# Altium project 2012_CARTE_FACTORISEE.PRJPCB
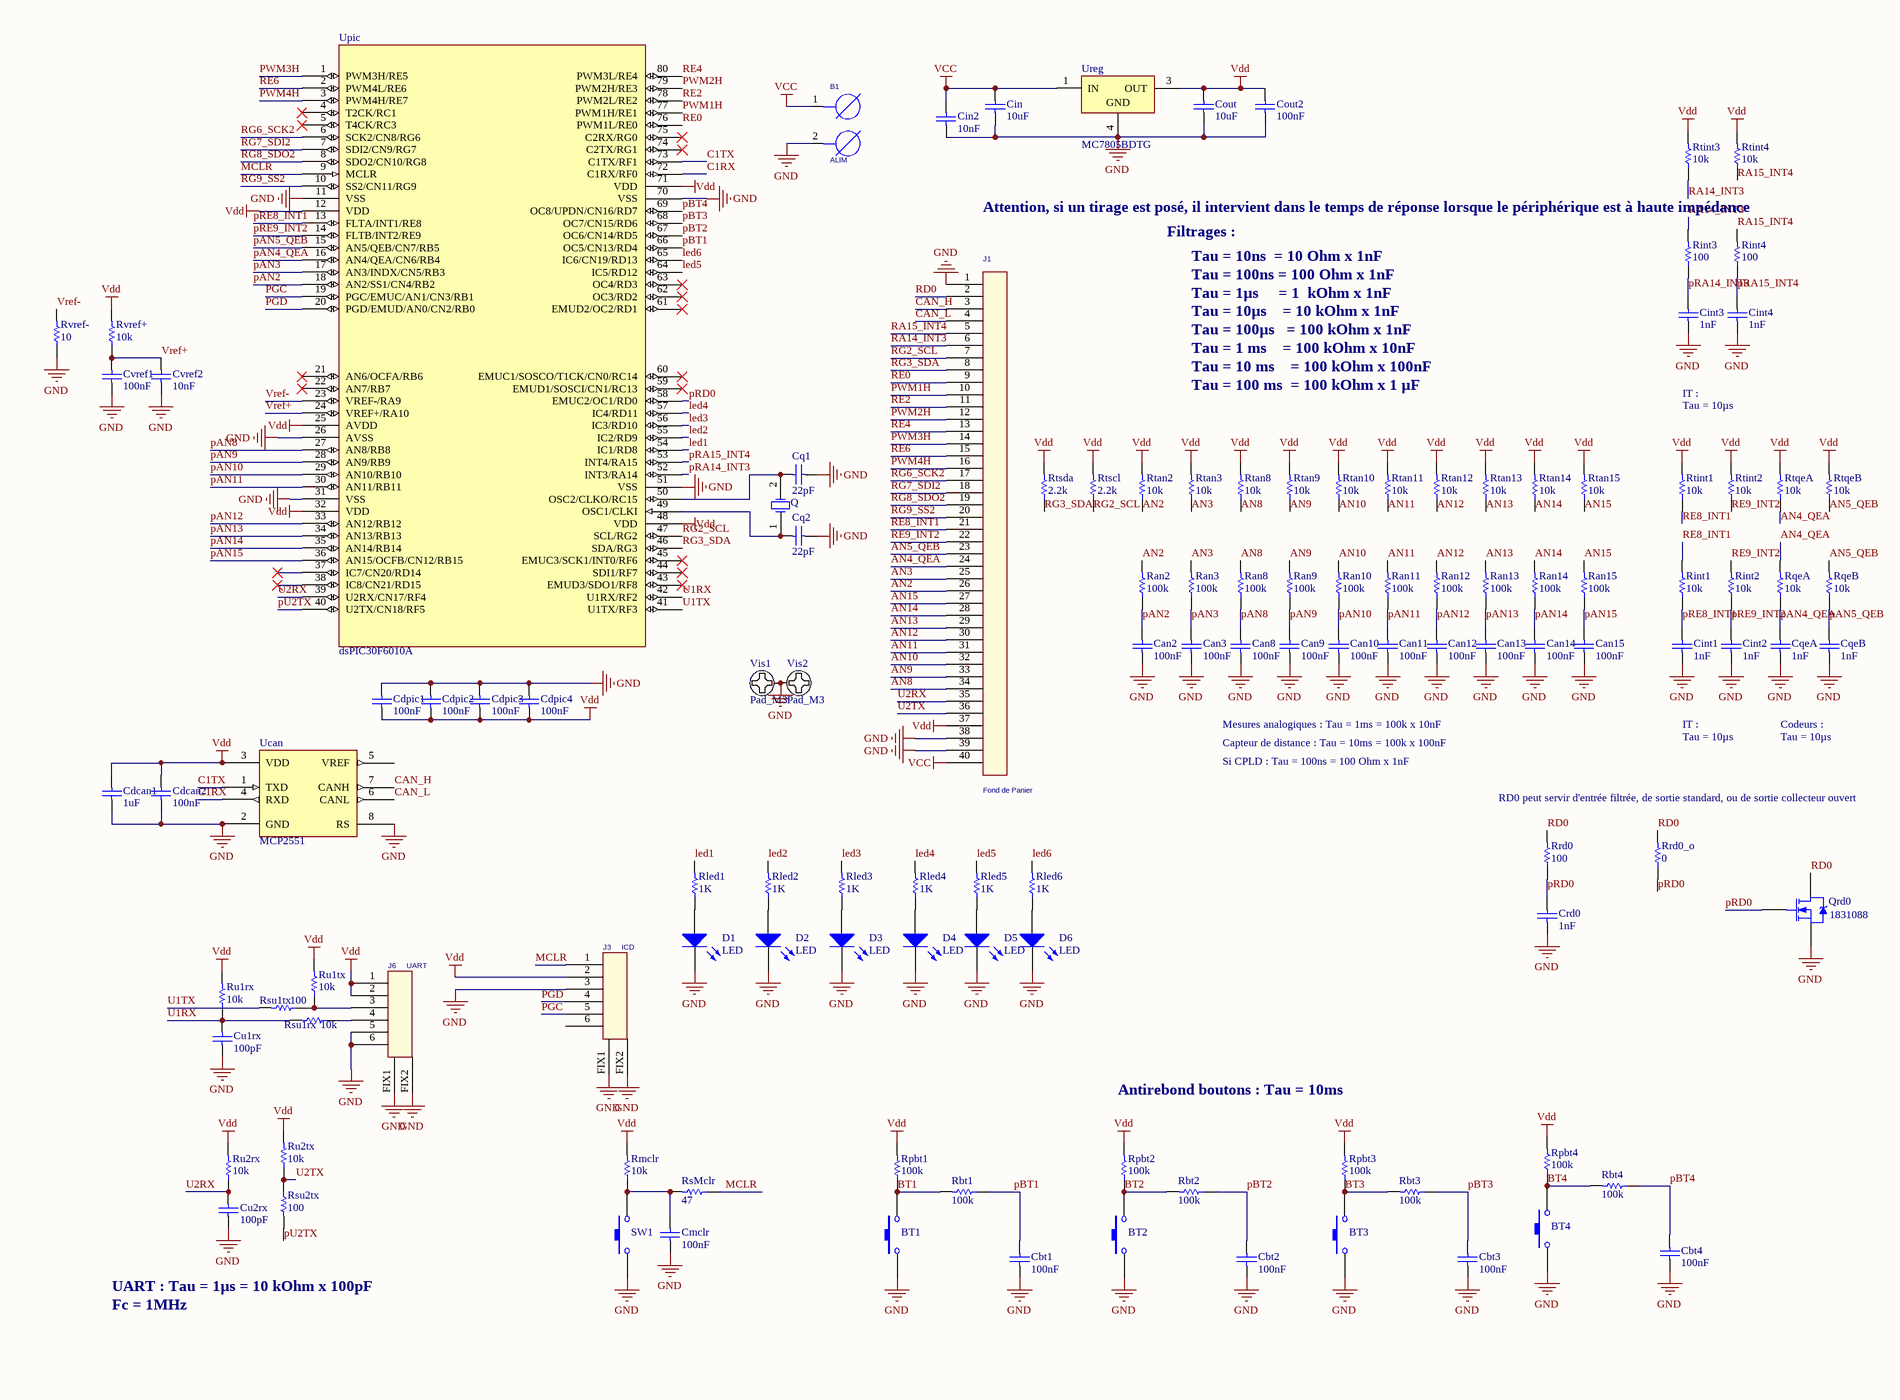
[diagram p0: 2012_Carte_Factorisee.SchDoc, left]
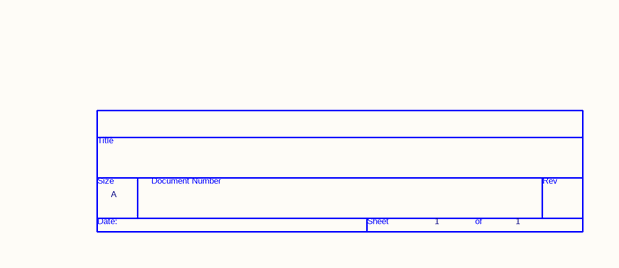
[diagram p1: 2012_Carte_Factorisee.SchDoc, right]
1 sheet, 122 parts. Net scope: global (net labels, ports and power ports of the same name join across sheets).
Board file: 2012_CARTE_FACTORISEE.PCBDOC

## Sheet 2012_Carte_Factorisee.SchDoc
size A3; PageSetup: Record=PageOptions|CenterHorizontal=True|CenterVertical=True|PrintScale=0.51|XCorrection=1.00|YCorrection=1.00|PrintKind=1|BorderSize=5000000|LeftOffset=0|BottomOffset=0|Orientation=2|PaperLength=1000|PaperWidth=1000|Scale=100|PaperSource=7|PrintQuality=-4|MediaType=1|DitherType=10|PaperKind=A3|PrintScaleMode=1

### Parts
*  Page Count: 1  Page Size: A  (hidden comment: TitleBlock0)  (graphical)
B1  ALIM  [BORNIER2]
BT1  SW_Pushbutton_6x6mm_Vertical  [Switch 6x6 Vertical]  (value not drawn)
BT2  SW_Pushbutton_6x6mm_Vertical  [Switch 6x6 Vertical]  (value not drawn)
BT3  SW_Pushbutton_6x6mm_Vertical  [Switch 6x6 Vertical]  (value not drawn)
BT4  SW_Pushbutton_6x6mm_Vertical  [Switch 6x6 Vertical]  (value not drawn)
Can2  100nF  [C0805_N]
Can3  100nF  [C0805_N]
Can8  100nF  [C0805_N]
Can9  100nF  [C0805_N]
Can10  100nF  [C0805_N]
Can11  100nF  [C0805_N]
Can12  100nF  [C0805_N]
Can13  100nF  [C0805_N]
Can14  100nF  [C0805_N]
Can15  100nF  [C0805_N]
Cbt1  100nF  [C0805_N]
Cbt2  100nF  [C0805_N]
Cbt3  100nF  [C0805_N]
Cbt4  100nF  [C0805_N]
Cdcan1  1uF  [C1206_N]
Cdcan2  100nF  [C0805_N]
Cdpic1  100nF  [C0805_N]
Cdpic2  100nF  [C0805_N]
Cdpic3  100nF  [C0805_N]
Cdpic4  100nF  [C0805_N]
Cin  10uF  [C1206_N]
Cin2  10nF  [C0805_N]
Cint1  1nF  [C0805_N]
Cint2  1nF  [C0805_N]
Cint3  1nF  [C0805_N]
Cint4  1nF  [C0805_N]
Cmclr  100nF  [C0805_N]
Cout  10uF  [C1206_N]
Cout2  100nF  [C0805_N]
Cq1  22pF  [C0805_N]
Cq2  22pF  [C0805_N]
CqeA  1nF  [C0805_N]
CqeB  1nF  [C0805_N]
Crd0  1nF  [C0805_N]
Cu1rx  100pF  [C0805_N]
Cu2rx  100pF  [C0805_N]
Cvref1  100nF  [C0805_N]
Cvref2  10nF  [C0805_N]
D1  LED  [LED_3mm]
D2  LED  [LED_3mm]
D3  LED  [LED_3mm]
D4  LED  [LED_3mm]
D5  LED  [LED_3mm]
D6  LED  [LED_3mm]
J1  Fond de Panier  [HE10/40_FACTO]
J3  ICD  [RJ11_6/6]
J6  UART  [RJ11_6/6]
Q  QU  [QUARTZ_DROIT_BP]  (value not drawn)
Qrd0  FAR: 1831088  [SOT23]
Ran2  100k  [R1206_N]
Ran3  100k  [R1206_N]
Ran8  100k  [R1206_N]
Ran9  100k  [R1206_N]
Ran10  100k  [R1206_N]
Ran11  100k  [R1206_N]
Ran12  100k  [R1206_N]
Ran13  100k  [R1206_N]
Ran14  100k  [R1206_N]
Ran15  100k  [R1206_N]
Rbt1  100k  [R1206_N]
Rbt2  100k  [R1206_N]
Rbt3  100k  [R1206_N]
Rbt4  100k  [R1206_N]
Rint1  10k  [R1206_N]
Rint2  10k  [R1206_N]
Rint3  100  [R1206_N]
Rint4  100  [R1206_N]
Rled1  1K  [R1206_N]
Rled2  1K  [R1206_N]
Rled3  1K  [R1206_N]
Rled4  1K  [R1206_N]
Rled5  1K  [R1206_N]
Rled6  1K  [R1206_N]
Rmclr  10k  [R1206_N]
Rpbt1  100k  [R1206_N]
Rpbt2  100k  [R1206_N]
Rpbt3  100k  [R1206_N]
Rpbt4  100k  [R1206_N]
RqeA  10k  [R1206_N]
RqeB  10k  [R1206_N]
Rrd0  100  [R1206_N]
Rrd0_o  0  [R1206_N]
RsMclr  47  [R1206_N]
Rsu1rx  10k  [R1206_N]
Rsu1tx  100  [R1206_N]
Rsu2tx  100  [R1206_N]
Rtan2  10k  [R1206_N]
Rtan3  10k  [R1206_N]
Rtan8  10k  [R1206_N]
Rtan9  10k  [R1206_N]
Rtan10  10k  [R1206_N]
Rtan11  10k  [R1206_N]
Rtan12  10k  [R1206_N]
Rtan13  10k  [R1206_N]
Rtan14  10k  [R1206_N]
Rtan15  10k  [R1206_N]
Rtint1  10k  [R1206_N]
Rtint2  10k  [R1206_N]
Rtint3  10k  [R1206_N]
Rtint4  10k  [R1206_N]
RtqeA  10k  [R1206_N]
RtqeB  10k  [R1206_N]
Rtscl  2.2k  [R1206_N]
Rtsda  2.2k  [R1206_N]
Ru1rx  10k  [R1206_N]
Ru1tx  10k  [R1206_N]
Ru2rx  10k  [R1206_N]
Ru2tx  10k  [R1206_N]
Rvref+  10k  [R1206_N]
Rvref-  10  [R1206_N]
SW1  SW_Pushbutton_6x6mm_Vertical  [Switch 6x6 Vertical]  (value not drawn)
Ucan  MCP2551  [SOIC150-8_N]
Upic  dsPIC30F6010A  [TQFP80_N]
Ureg  MC7805BDTG  [369A-13]
Vis1  Pad_M3  [M3x6mm]
Vis2  Pad_M3  [M3x6mm]

### Nets
GND: B1.2(B2) BT1.1 BT2.1 BT3.1 BT4.1 Can2.1 Can3.1 Can8.1 Can9.1 Can10.1 Can11.1 Can12.1 Can13.1 Can14.1 Can15.1 Cbt1.1 Cbt2.1 Cbt3.1 Cbt4.1 Cdcan1.1 Cdcan2.1 Cdpic1.2 Cdpic2.2 Cdpic3.2 Cdpic4.2 Cin.1 Cin2.1 Cint1.1 Cint2.1 Cint3.1 Cint4.1 Cmclr.1 Cout.1 Cout2.1 Cq1.2 Cq2.2 CqeA.1 CqeB.1 Crd0.1 Cu1rx.1 Cu2rx.1 Cvref1.1 Cvref2.1 D1.2 D2.2 D3.2 D4.2 D5.2 D6.2 J1.1 J1.38 J1.39 J3.3 J3.FIX1 J3.FIX2 J6.5 J6.6 J6.FIX1 J6.FIX2 Qrd0.2(S) Rvref-.1 SW1.1 Ucan.2(GND) Ucan.8(RS) Upic.11(VSS) Upic.26(AVSS) Upic.31(VSS) Upic.51(VSS) Upic.70(VSS) Ureg.4(GND) Vis1.1 Vis2.1
VCC: B1.1(B1) Cin.2 Cin2.2 J1.40 Ureg.1(IN)
Vdd: Cdcan1.2 Cdcan2.2 Cdpic1.1 Cdpic2.1 Cdpic3.1 Cdpic4.1 Cout.2 Cout2.2 J1.37 J3.2 J6.1 J6.2 Rmclr.2 Rpbt1.2 Rpbt2.2 Rpbt3.2 Rpbt4.2 Rtan2.2 Rtan3.2 Rtan8.2 Rtan9.2 Rtan10.2 Rtan11.2 Rtan12.2 Rtan13.2 Rtan14.2 Rtan15.2 Rtint1.2 Rtint2.2 Rtint3.2 Rtint4.2 RtqeA.2 RtqeB.2 Rtscl.2 Rtsda.2 Ru1rx.2 Ru1tx.2 Ru2rx.2 Ru2tx.2 Rvref+.2 Ucan.3(VDD) Upic.12(VDD) Upic.25(AVDD) Upic.32(VDD) Upic.48(VDD) Upic.71(VDD) Ureg.3(OUT)
AN2: J1.26 Ran2.2 Rtan2.1
AN3: J1.25 Ran3.2 Rtan3.1
AN4_QEA: J1.24 RqeA.2 RtqeA.1
AN5_QEB: J1.23 RqeB.2 RtqeB.1
AN8: J1.34 Ran8.2 Rtan8.1
AN9: J1.33 Ran9.2 Rtan9.1
AN10: J1.32 Ran10.2 Rtan10.1
AN11: J1.31 Ran11.2 Rtan11.1
AN12: J1.30 Ran12.2 Rtan12.1
AN13: J1.29 Ran13.2 Rtan13.1
AN14: J1.28 Ran14.2 Rtan14.1
AN15: J1.27 Ran15.2 Rtan15.1
BT1: BT1.3 Rbt1.2 Rpbt1.1
BT2: BT2.3 Rbt2.2 Rpbt2.1
BT3: BT3.3 Rbt3.2 Rpbt3.1
BT4: BT4.3 Rbt4.2 Rpbt4.1
C1RX: Ucan.4(RXD) Upic.72(C1RX/RF0)
C1TX: Ucan.1(TXD) Upic.73(C1TX/RF1)
CAN_H: J1.3 Ucan.7(CANH)
CAN_L: J1.4 Ucan.6(CANL)
led1: Rled1.2 Upic.54(IC1/RD8)
led2: Rled2.2 Upic.55(IC2/RD9)
led3: Rled3.2 Upic.56(IC3/RD10)
led4: Rled4.2 Upic.57(IC4/RD11)
led5: Rled5.2 Upic.64(IC5/RD12)
led6: Rled6.2 Upic.65(IC6/CN19/RD13)
MCLR: J3.1 RsMclr.1 Upic.9(MCLR)
pAN2: Can2.2 Ran2.1 Upic.18(AN2/SS1/CN4/RB2)
pAN3: Can3.2 Ran3.1 Upic.17(AN3/INDX/CN5/RB3)
pAN4_QEA: CqeA.2 RqeA.1 Upic.16(AN4/QEA/CN6/RB4)
pAN5_QEB: CqeB.2 RqeB.1 Upic.15(AN5/QEB/CN7/RB5)
pAN8: Can8.2 Ran8.1 Upic.27(AN8/RB8)
pAN9: Can9.2 Ran9.1 Upic.28(AN9/RB9)
pAN10: Can10.2 Ran10.1 Upic.29(AN10/RB10)
pAN11: Can11.2 Ran11.1 Upic.30(AN11/RB11)
pAN12: Can12.2 Ran12.1 Upic.33(AN12/RB12)
pAN13: Can13.2 Ran13.1 Upic.34(AN13/RB13)
pAN14: Can14.2 Ran14.1 Upic.35(AN14/RB14)
pAN15: Can15.2 Ran15.1 Upic.36(AN15/OCFB/CN12/RB15)
pBT1: Cbt1.2 Rbt1.1 Upic.66(OC5/CN13/RD4)
pBT2: Cbt2.2 Rbt2.1 Upic.67(OC6/CN14/RD5)
pBT3: Cbt3.2 Rbt3.1 Upic.68(OC7/CN15/RD6)
pBT4: Cbt4.2 Rbt4.1 Upic.69(OC8/UPDN/CN16/RD7)
PGC: J3.5 Upic.19(PGC/EMUC/AN1/CN3/RB1)
PGD: J3.4 Upic.20(PGD/EMUD/AN0/CN2/RB0)
pRA14_INT3: Cint3.2 Rint3.1 Upic.52(INT3/RA14)
pRA15_INT4: Cint4.2 Rint4.1 Upic.53(INT4/RA15)
pRD0: Crd0.2 Qrd0.1(G) Rrd0.1 Rrd0_o.1 Upic.58(EMUC2/OC1/RD0)
pRE8_INT1: Cint1.2 Rint1.1 Upic.13(FLTA/INT1/RE8)
pRE9_INT2: Cint2.2 Rint2.1 Upic.14(FLTB/INT2/RE9)
pU2TX: Rsu2tx.2 Upic.40(U2TX/CN18/RF5)
PWM1H: J1.10 Upic.77(PWM1H/RE1)
PWM2H: J1.12 Upic.79(PWM2H/RE3)
PWM3H: J1.14 Upic.1(PWM3H/RE5)
PWM4H: J1.16 Upic.3(PWM4H/RE7)
RA14_INT3: J1.6 Rint3.2 Rtint3.1
RA15_INT4: J1.5 Rint4.2 Rtint4.1
RD0: J1.2 Qrd0.3(D) Rrd0.2 Rrd0_o.2
RE0: J1.9 Upic.76(PWM1L/RE0)
RE2: J1.11 Upic.78(PWM2L/RE2)
RE4: J1.13 Upic.80(PWM3L/RE4)
RE6: J1.15 Upic.2(PWM4L/RE6)
RE8_INT1: J1.21 Rint1.2 Rtint1.1
RE9_INT2: J1.22 Rint2.2 Rtint2.1
RG2_SCL: J1.7 Rtscl.1 Upic.47(SCL/RG2)
RG3_SDA: J1.8 Rtsda.1 Upic.46(SDA/RG3)
RG6_SCK2: J1.17 Upic.6(SCK2/CN8/RG6)
RG7_SDI2: J1.18 Upic.7(SDI2/CN9/RG7)
RG8_SDO2: J1.19 Upic.8(SDO2/CN10/RG8)
RG9_SS2: J1.20 Upic.10(SS2/CN11/RG9)
U1RX: Cu1rx.2 Rsu1rx.2 Ru1rx.1 Upic.42(U1RX/RF2)
U1TX: Rsu1tx.2 Upic.41(U1TX/RF3)
U2RX: Cu2rx.2 J1.35 Ru2rx.1 Upic.39(U2RX/CN17/RF4)
U2TX: J1.36 Rsu2tx.1 Ru2tx.1
Vref+: Cvref1.2 Cvref2.2 Rvref+.1 Upic.24(VREF+/RA10)
Vref-: Rvref-.2 Upic.23(VREF-/RA9)
NetCmclr_2: Cmclr.2 Rmclr.1 RsMclr.2 SW1.3
NetCq1_1: Cq1.1 Q.2(OSC2) Upic.50(OSC2/CLKO/RC15)
NetCq2_1: Cq2.1 Q.1(OSC1) Upic.49(OSC1/CLKI)
NetD1_1: D1.1 Rled1.1
NetD2_1: D2.1 Rled2.1
NetD3_1: D3.1 Rled3.1
NetD4_1: D4.1 Rled4.1
NetD5_1: D5.1 Rled5.1
NetD6_1: D6.1 Rled6.1
NetJ6_3: J6.3 Rsu1tx.1 Ru1tx.1
NetJ6_4: J6.4 Rsu1rx.1

Not connected (* = marked no-connect by the designer): J3 6; Ucan 5(VREF); Upic 4(T2CK/RC1)* 5(T4CK/RC3)* 21(AN6/OCFA/RB6)* 22(AN7/RB7)* 37(IC7/CN20/RD14)* 38(IC8/CN21/RD15)* 43(EMUD3/SDO1/RF8)* 44(SDI1/RF7)* 45(EMUC3/SCK1/INT0/RF6)* 59(EMUD1/SOSCI/CN1/RC13)* 60(EMUC1/SOSCO/T1CK/CN0/RC14)* 61(EMUD2/OC2/RD1)* 62(OC3/RD2)* 63(OC4/RD3)* 74(C2TX/RG1)* 75(C2RX/RG0)*

### Notes on the sheet
- Attention, si un tirage est posé, il intervient dans le temps de réponse lorsque le périphérique est à haute impédance
- Filtrages :
- Tau = 100ns = 100 Ohm x 1nF
- Tau = 1µs     = 1  kOhm x 1nF
- Tau = 10ns  = 10 Ohm x 1nF
- Tau = 10µs    = 10 kOhm x 1nF
- Tau = 100µs   = 100 kOhm x 1nF
- Tau = 1 ms    = 100 kOhm x 10nF
- Tau = 10 ms    = 100 kOhm x 100nF
- Tau = 100 ms  = 100 kOhm x 1 µF
- Tau = 10µs
- IT :
- Mesures analogiques : Tau = 1ms = 100k x 10nF
- Codeurs :
- Si CPLD : Tau = 100ns = 100 Ohm x 1nF
- Capteur de distance : Tau = 10ms = 100k x 100nF
- RD0 peut servir d'entrée filtrée, de sortie standard, ou de sortie collecteur ouvert
- Antirebond boutons : Tau = 10ms
- UART : Tau = 1µs = 10 kOhm x 100pF
- Fc = 1MHz
- (in symbol TitleBlock0) Title; Size; Document Number; Rev; Date:; Sheet; of

### Library data of the parts
B1 = BORNIER2
BT1-BT4 SW1 = SW_Pushbutton_6x6mm_Vertical: Switch tactil 6mm x 6mm Vertical; Published: 27/11/09; PackageReference: 6mm X 6mm; Publisher: Damien Guitton
Can2 Can3 Can8-Can15 Cbt1-Cbt4 Cdcan1 Cdcan2 Cdpic1-Cdpic4 Cin Cin2 Cint1-Cint4 Cmclr Cout Cout2 Cq1 Cq2 CqeA CqeB Crd0 Cu1rx Cu2rx Cvref1 Cvref2 = Capacitor: Published: 8-Jun-2000; LatestRevisionDate: 17-Jul-2002; LatestRevisionNote: Re-released for DXP Platform.; PackageReference: RAD-0.3; Publisher: Altium Limited
D1-D6 = LED: Typical LED; Published: 8-Jun-2000; LatestRevisionDate: 08-Jul-2005; LatestRevisionNote: Mech Layer 1 removed.; PackageReference: LED-1; Publisher: Altium Limited
J1 = CONNECTEUR_HE10_40
J3 J6 = CONNECTEUR_RJ12
Q = QUARTZ_DROIT_BAS_PROFIL: Crystal Oscillator; FAR: 1666999; FAR: test; Published: 8-Jun-2000; LatestRevisionDate: 17-Jul-2002; LatestRevisionNote: Re-released for DXP Platform.; PackageReference: R38; Publisher: Altium Limited; Type: DROIT_BAS_PROFIL
Qrd0 = FDP100N10: MOSFET N-CH; Description: MOSFET N
Ran2 Ran3 Ran8-Ran15 Rbt1-Rbt4 Rint1-Rint4 Rled1-Rled6 Rmclr Rpbt1-Rpbt4 RqeA RqeB Rrd0 Rrd0_o RsMclr Rsu1rx Rsu1tx Rsu2tx Rtan2 Rtan3 Rtan8-Rtan15 Rtint1-Rtint4 RtqeA RtqeB Rtscl Rtsda Ru1rx Ru1tx Ru2rx Ru2tx Rvref+ Rvref- = Resistor: Published: 8-Jun-2000; LatestRevisionDate: 17-Jul-2002; LatestRevisionNote: Re-released for DXP Platform.; PackageReference: AXIAL-0.5; Publisher: Altium Limited
Ucan = MCP2551: High Speed Can Transceiver; Published: 6-Oct-2005; LatestRevisionDate: 13-Apr-2006; LatestRevisionNote: IPC-7351 Footprint Added.; DatasheetVersion: Nov-2003; PackageVersion: Oct-2005; PackageReference: SOIC150-8; Publisher: Altium Limited; PackageDescription: 8-Pin Plastic Narrow Body Small Outline Integrated Circuit 1.27 mm Pitch; Code_JEDEC: MS-012; ComponentLink1Description: Manufacturer Link; ComponentLink1URL: http://www.microchip.com; ComponentLink2Description: Datasheet; ComponentLink2URL: http://ww1.microchip.com/downloads/en/DeviceDoc/21667d.pdf
Upic = dsPIC30F6010A: High-Performance, 16-bit Digital Signal Controllers
Ureg = MC7805ACD2T: Three-Terminal Positive Voltage Regulator; Note: Pin 2 is electrically connected to Pin 4; Pin 2 is trimmed and not drawn;; Published: 15-Apr-2002; DatasheetVersion: 1997; PackageVersion: 1997; PackageReference: 936-03; Publisher: Altium Limited; PackageDescription: D2-PAK/TO-263-AB; 3 Leads (1 Cropped); Body 14.7 (inc. leads) x 10.2 mm (LxW max); ComponentLink1Description: Manufacturer Link; ComponentLink1URL: http://www.onsemi.com/site/products/taxonomy/0,4438,503,00.html; ComponentLink2Description: Datasheet; ComponentLink2URL: http://www.onsemi.com/pub/Collateral/MC7800-D.PDF
Vis1 Vis2 = Vis M3 X 6mm _TORX_Tête 6mm: Publisher: Damien Guitton
* = TitleBlock0: Page Number: 1; Page Create Date: March  8, 1995